# EAGLE design ZIntermediar2023 (EAGLE 6.5.0)
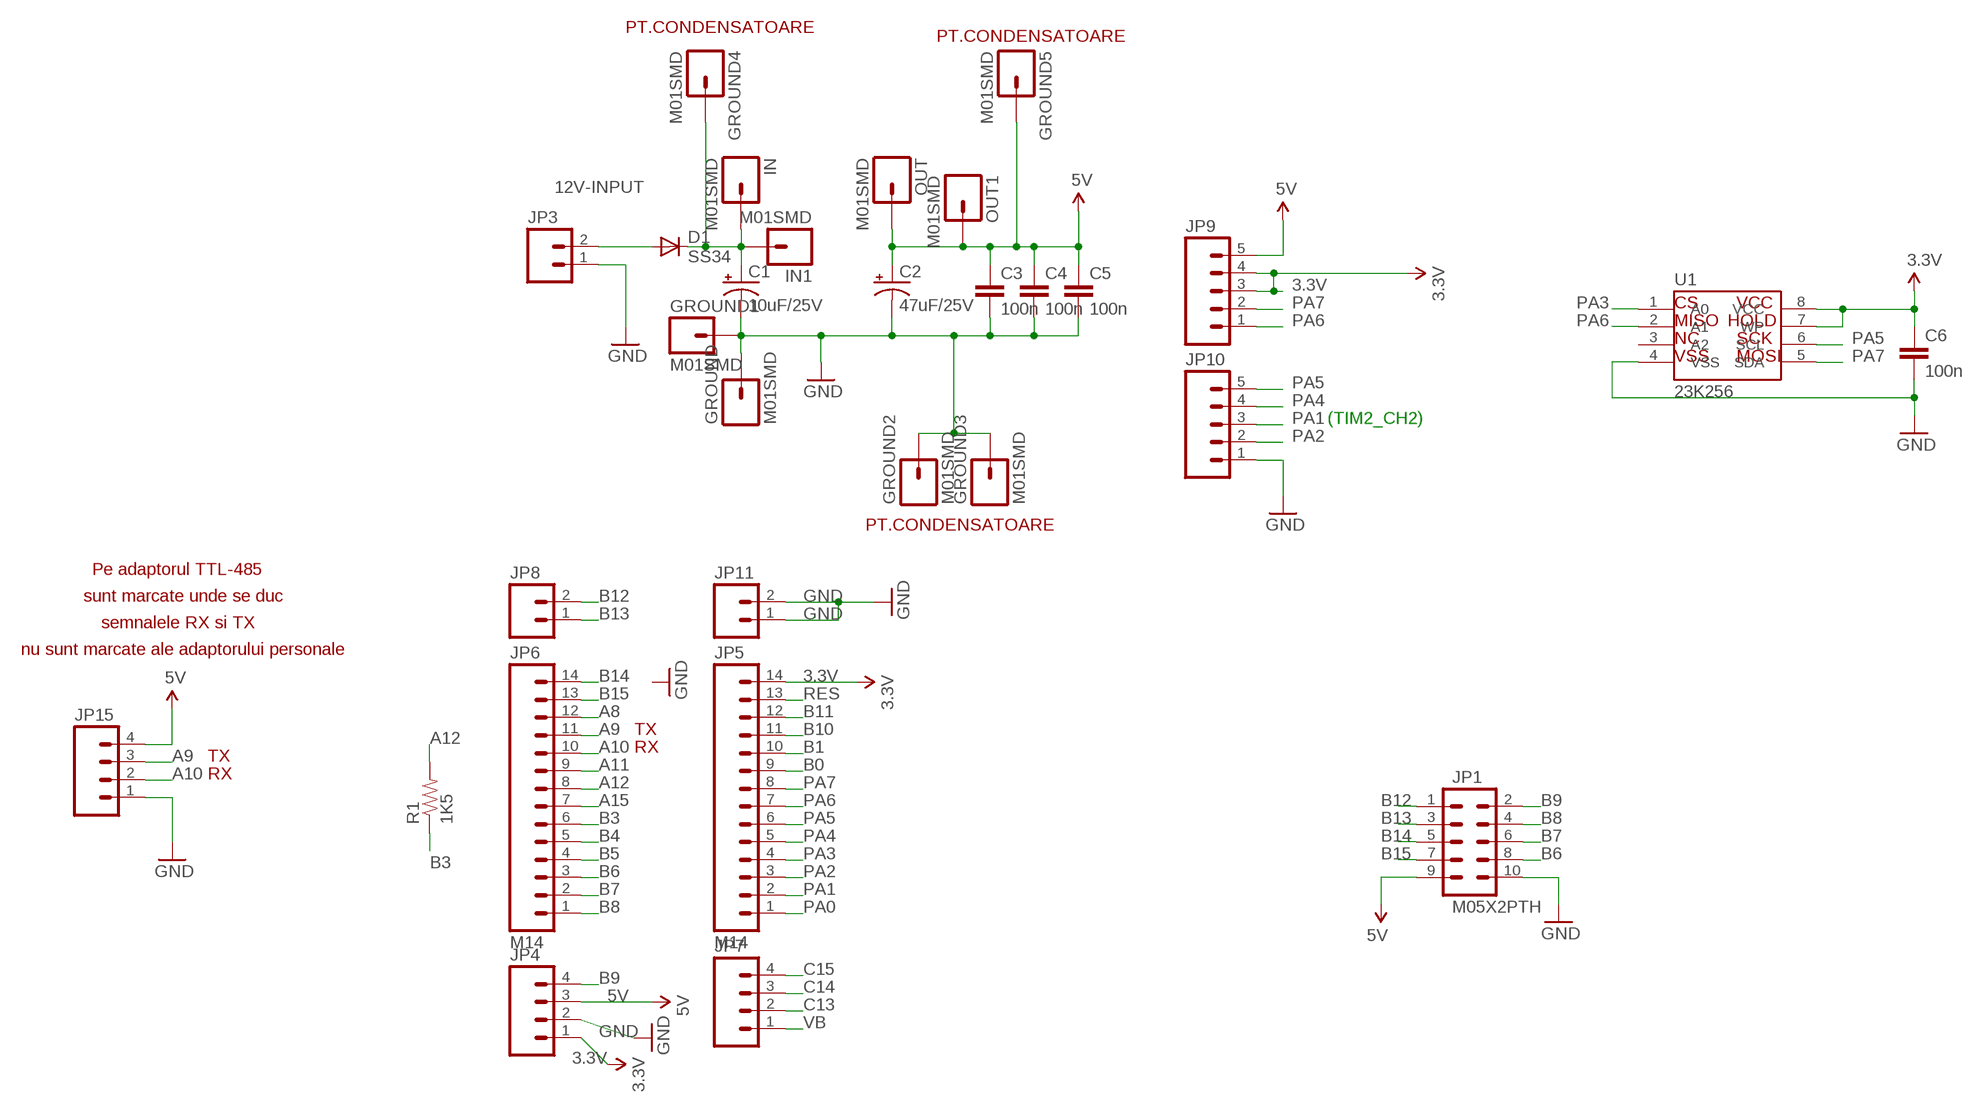
[diagram p0: schematic, sheet 1]

## Parts
C1  10uF/25V  CAP_POLE  [PANASONIC_E]
C2  47uF/25V  CAP_POLE  [PANASONIC_E]
C3  100n  CAP1206  [1206]
C4  100n  CAP1206  [1206]
C5  100n  CAP1206  [1206]
C6  100n  CAP1206  [1206]
D1  SS34  DIODE-SMC  [SMC]
GROUND  M01SMD  [LUXEON-PAD]
GROUND1  M01SMD  [LUXEON-PAD]
GROUND2  M01SMD  [LUXEON-PAD]
GROUND3  M01SMD  [LUXEON-PAD]
GROUND4  M01SMD  [LUXEON-PAD]
GROUND5  M01SMD  [LUXEON-PAD]
IN  M01SMD  [LUXEON-PAD]
IN1  M01SMD  [LUXEON-PAD]
JP1  M05X2PTH  [AVR_ICSP]
JP3  M025MM  [SCREWTERMINAL-5MM-2]
JP4  M04PTH  [1X04]
JP5  M14  [1X14]
JP6  M14  [1X14]
JP7  M04PTH  [1X04]
JP8  M02PTH  [1X02]
JP9  M05PTH_LONGPADS  [1X05_LONGPADS]
JP10  M05PTH_LONGPADS  [1X05_LONGPADS]
JP11  M02PTH  [1X02]
JP15  M04LONGPADS  [1X04_LONGPADS]
OUT  M01SMD  [LUXEON-PAD]
OUT1  M01SMD  [LUXEON-PAD]
R1  1K5  RESISTOR1206  [1206]
U1  23K256  EEPROM-I2CSMD  [SO08]

## Nets
3.3V: C6.1 JP4.1 JP5.14 JP9.3 JP9.4 U1.7(WP) U1.8(VCC)
5V: C2.+ C3.1 C4.1 C5.1 GROUND5.P$1 JP1.9 JP4.3 JP9.5 JP15.4 OUT1.P$1 OUT.P$1
12V-INPUT: C1.+ D1.C GROUND4.P$1 IN1.P$1 IN.P$1
A8: JP6.12
A9: JP6.11 JP15.3
A10: JP6.10 JP15.2
A11: JP6.9
A12: JP6.8 R1.2
A15: JP6.7
B0: JP5.9
B1: JP5.10
B3: JP6.6 R1.1
B4: JP6.5
B5: JP6.4
B6: JP1.8 JP6.3
B7: JP1.6 JP6.2
B8: JP1.4 JP6.1
B9: JP1.2 JP4.4
B10: JP5.11
B11: JP5.12
B12: JP1.1 JP8.2
B13: JP1.3 JP8.1
B14: JP1.5 JP6.14
B15: JP1.7 JP6.13
C13: JP7.2
C14: JP7.3
C15: JP7.4
GND: C1.- C2.- C3.2 C4.2 C5.2 C6.2 GROUND1.P$1 GROUND2.P$1 GROUND3.P$1 GROUND.P$1 JP1.10 JP3.1 JP4.2 JP10.1 JP11.1 JP11.2 JP15.1 U1.4(VSS)
N$7: D1.A JP3.2
PA0: JP5.1
PA1: JP5.2 JP10.3
PA2: JP5.3 JP10.2
PA3: JP5.4 U1.1(A0)
PA4: JP5.5 JP10.4
PA5: JP5.6 JP10.5 U1.6(SCL)
PA6: JP5.7 JP9.1 U1.2(A1)
PA7: JP5.8 JP9.2 U1.5(SDA)
RES: JP5.13
VB: JP7.1
Unconnected: U1.3(A2)

## Notes on the sheet
- PT.CONDENSATOARE
- PT.CONDENSATOARE
- CS | VCC
- MISO | HOLD
- NC | SCK
- VSS | MOSI
- (TIM2_CH2)
- PT.CONDENSATOARE
- Pe adaptorul TTL-485
- sunt marcate unde se duc
- semnalele RX si TX
- nu sunt marcate ale adaptorului personale
- TX
- RX
- TX
- RX

## Library data of the parts
C1 C2 = SparkFun-Passives:CAP_POL: Capacitor Polarized These are standard SMD and PTH capacitors. Normally 10uF, 47uF, and 100uF in electrolytic and tantalum varieties. Always verify the external diameter of the through hole cap, it varies with capacity, voltage, and manufacturer. The EIA devices should be standard.
C3-C6 = SparkFun-Passives:CAP: Capacitor Standard 0603 ceramic capacitor, and 0.1" leaded capacitor.
D1 = diode:DIODE-: DIODE
GROUND GROUND1-GROUND5 IN IN1 OUT OUT1 = SparkFun-Connectors:M01: Header 1 Standard 1-pin 0.1" header. Use with straight break away headers (SKU : PRT-00116), right angle break away headers (PRT-00553), swiss pins (PRT-00743), machine pins (PRT-00117), and female headers (PRT-00115).
JP1 = SparkFun-Connectors:M05X2: Header 5x2 Standard 10-pin dual row 0.1" header. Commonly used with AVR-ISP. Use with Spark Fun Electronics SKU: PRT-00778
JP3 JP8 JP11 = SparkFun-Connectors:M02: Header 2 Standard 2-pin 0.1" header. Use with straight break away headers (SKU : PRT-00116), right angle break away headers (PRT-00553), swiss pins (PRT-00743), machine pins (PRT-00117), and female headers (PRT-00115). Molex polarized connector foot print use with SKU : PRT-08233 with associated crimp pins and housings.
JP4 JP7 JP15 = SparkFun-Connectors:M04: Header 4 Standard 4-pin 0.1" header. Use with straight break away headers (SKU : PRT-00116), right angle break away headers (PRT-00553), swiss pins (PRT-00743), machine pins (PRT-00117), and female headers (PRT-00115). Molex polarized connector foot print use with SKU : PRT-08231 with associated crimp pins and housings. 1MM SMD Version SKU: PRT-10208
JP5 JP6 = SparkFun-Connectors:M14: Header 14 Standard 14-pin 0.1" header. Use with straight break away headers (SKU : PRT-00116), right angle break away headers (PRT-00553), swiss pins (PRT-00743), machine pins (PRT-00117), and female headers (PRT-00115).
JP9 JP10 = SparkFun-Connectors:M05: Header 5 Standard 5-pin 0.1" header. Use with straight break away headers (SKU : PRT-00116), right angle break away headers (PRT-00553), swiss pins (PRT-00743), machine pins (PRT-00117), and female headers (PRT-00115). Molex polarized connector foot print use with SKU : PRT-08230 with associated crimp pins and housings.
R1 = SparkFun-Passives:RESISTOR: Resistor Basic schematic elements and footprints for 0603, 1206, and PTH resistors.
U1 = SparkFun-DigitalIC:EEPROM-I2C: I2C EEPROM chips, 24LC256 (and others)

## Board
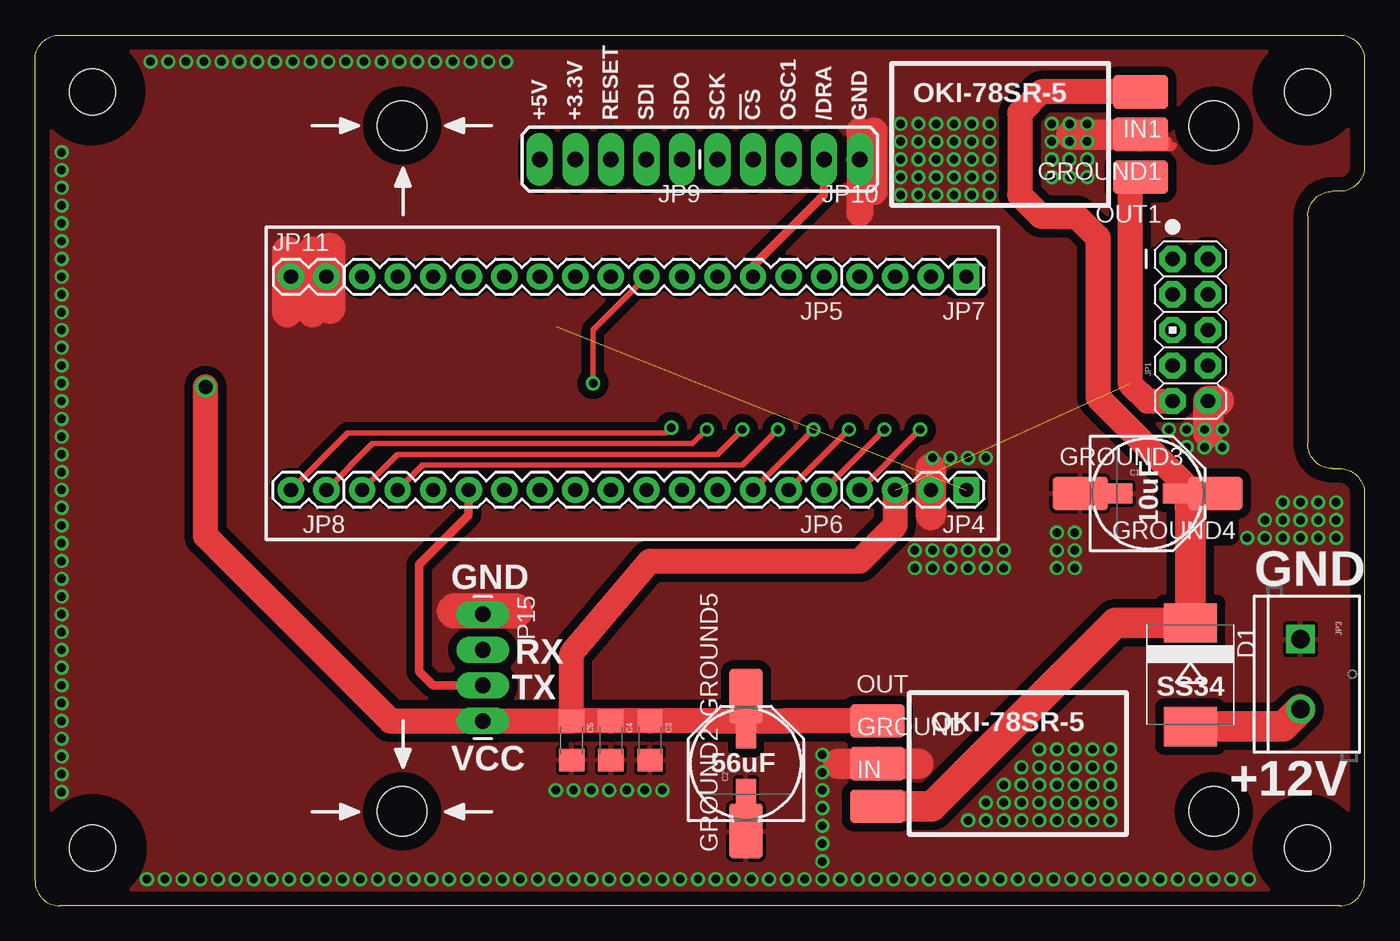
[diagram p1: board, top side]
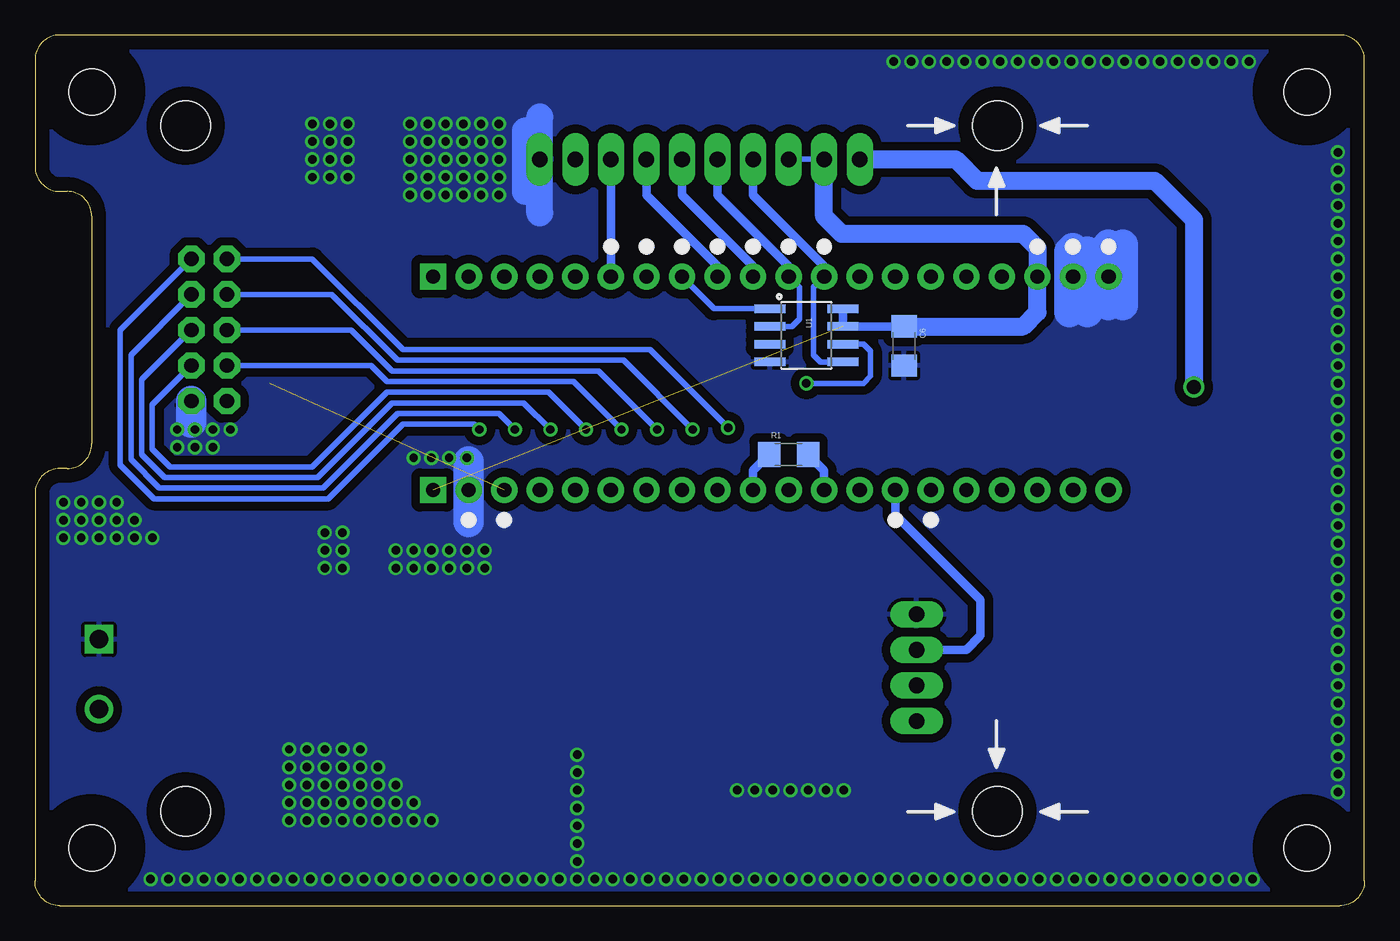
[diagram p2: board, bottom side, seen from below]

Size 95 x 62.23 mm. Coordinates in mm from the lower left corner, seen from the top.
Outline: 0,1.78 0,60.45 arc-90 1.78,62.23 93.22,62.23 arc-90 95,60.45 95,52.83 arc-90 93.22,51.05 92.71,51.05 arc90 90.93,49.28 90.93,33.02 arc90 92.71,31.24 93.22,31.24 arc-90 95,29.46 95,1.78 arc-90 93.22,0 1.78,0 arc-90 0,1.78
Copper layers (1*16): Top 0.035mm / dielectric 1.5mm / Bottom 0.035mm
Design rules "default *": minimum track width 10mil, minimum drill 24mil, track to track 8mil, track to pad 8mil, pad to pad 8mil, via to via 8mil, smd to smd 8mil, copper to edge 40mil, drill to drill 8mil, minimum pad ring 10mil, minimum via ring 8mil, stop-mask expansion 4mil, vias tented up to drill 24mil, thermal gap 10mil
Holes 3.56 mm at 26.23,55.75 84.23,6.76 26.23,6.76 84.23,55.75
tRestrict: area 1.5,1.5 to 6.7,6.7; area 1.4,55.6 to 6.6,60.8; area 88.3,1.5 to 93.5,6.7; area 88.3,55.6 to 93.5,60.8; area 84.4,26.4 to 85.4,27.7
bRestrict: area 1.5,1.5 to 6.7,6.7; area 1.5,55.6 to 6.7,60.8; area 88.4,55.6 to 93.6,60.8; area 88.4,1.5 to 93.6,6.7

### Footprints (pad centres in the part's own frame; a part is rotated, then mirrored left to right if it is on the bottom)
PANASONIC_E = smd 3.8 x 1.4: + 3,0; - -3,0
1206 = smd 1.6 x 1.8: 1 -1.4,0; 2 1.4,0
SMC = smd 2.8 x 3.8: A 3.7,0; C -3.7,0
LUXEON-PAD = smd 3.9 x 2.4: P$1 0,0
AVR_ICSP = drill 1.016 pad 1.88 octagon: 1 -1.27,5.08; 2 1.27,5.08; 3 -1.27,2.54; 4 1.27,2.54; 5 -1.27,0; 6 1.27,0; 7 -1.27,-2.54; 8 1.27,-2.54; 9 -1.27,-5.08; 10 1.27,-5.08
SCREWTERMINAL-5MM-2 = drill 1.3 pad 2.032 square: 1 0,0 | drill 1.3 pad 2.032: 2 5,0
1X04 = drill 1.016 pad 1.88 square: 1 0,0 | drill 1.016 pad 1.88: 2 2.54,0; 3 5.08,0; 4 7.62,0
1X14 = drill 1.016 pad 1.88: 1 0,0; 2 2.54,0; 3 5.08,0; 4 7.62,0; 5 10.16,0; 6 12.7,0; 7 15.24,0; 8 17.78,0; 9 20.32,0; 10 22.86,0; 11 25.4,0; 12 27.94,0; 13 30.48,0; 14 33.02,0
1X02 = drill 1.016 pad 1.88: 1 0,0; 2 2.54,0
1X05_LONGPADS = drill 1.118 pad 1.88 long: 1 0,0; 2 2.54,0; 3 5.08,0; 4 7.62,0; 5 10.16,0
1X04_LONGPADS = drill 1.118 pad 1.88 long: 1 0,0; 2 2.54,0; 3 5.08,0; 4 7.62,0
STAND-OFF = hole 3.302: 0,0
SO08 = smd 0.61 x 2.21: 1 -1.905,-2.616; 2 -0.635,-2.616; 3 0.635,-2.616; 4 1.905,-2.616; 5 1.905,2.616; 6 0.635,2.616; 7 -0.635,2.616; 8 -1.905,2.616

### Placement (x,y rotation side)
C1  79.5,29.46 0 top
C2  50.8,10.16 90 top
C3  43.94,11.81 270 top
C4  41.15,11.81 270 top
C5  38.35,11.81 270 top
C6  32.89,40.01 270 bottom
D1  82.55,16.51 270 top
GROUND  60.2,10.16 0 top
GROUND1  78.99,55.12 180 top
GROUND2  50.8,5.33 90 top
GROUND3  74.68,29.46 0 top
GROUND4  84.33,29.46 180 top
GROUND5  50.8,14.99 90 top
IN  60.2,7.11 0 top
IN1  78.99,58.17 180 top
JP1  82.55,41.15 0 top
JP3  90.42,19.05 270 top
JP4  66.55,29.72 180 top
JP5  56.39,44.96 180 top
JP6  56.39,29.72 180 top
JP7  66.55,44.96 180 top
JP8  20.83,29.72 180 top
JP9  46.23,53.34 180 top
JP10  58.93,53.34 180 top
JP11  18.29,44.96 0 top
JP15  32,20.83 270 top
OUT  60.2,13.21 0 top
OUT1  78.99,52.07 180 top
R1  41.15,32.26 0 bottom
STANDOFF1  STAND-OFF  [STAND-OFF]  90.93,4.11 0 top
STANDOFF6  STAND-OFF  [STAND-OFF]  4.11,58.17 0 top
STANDOFF10  STAND-OFF  [STAND-OFF]  90.93,58.17 0 top
STANDOFF12  STAND-OFF  [STAND-OFF]  4.11,4.11 0 top
U1  39.88,40.77 270 bottom

### Tracks (layer width: path | path; a pad name or v marks a point on that pad's centre or on a via)
3.3V  (1 unrouted)
  Bottom 0.406: JP9.4 JP9.3
  Bottom 0.61: U1.8 U1.7 34.29,41.4 C6.1
  Bottom 1.27: JP9.4 38.61,49.28 37.34,48.01 24.38,48.01 23.37,46.99 JP5.14 23.37,42.42 24.38,41.41 C6.1
5V  (via drill 1)  (1 unrouted)
  Top 0.356: 53.72,13.21 53.21,13.16 C2.+
  Top 0.406: GROUND5.P$1 C2.+
  Top 1.27: 53.39,13.21 C2.+
  Top 1.778: OUT.P$1 53.72,13.21 53.39,13.21 49.4,13.21 48.9,13.21 C3.1 C4.1 C5.1 | JP1.9 79.5,36.07 78.23,37.34 78.23,52.07 OUT1.P$1 | C5.1 38.35,18.03 43.94,24.64 58.93,24.64 61.47,27.18 JP4.3 | C5.1 34.8,13.21 34.79,13.21 JP15.4 25.4,13.21 12.19,26.42 v12.19,37.08
  Bottom 1.27: JP9.5 29.21,53.34 27.69,51.82 14.99,51.82 12.19,49.02 v12.19,37.08
12V-INPUT
  Top 0.406: C1.+ GROUND4.P$1
  Top 0.61: 82.5,26.72 C1.+
  Top 1.778: IN1.P$1 71.88,58.17 70.36,56.64 70.36,50.8 71.88,49.28 74.42,49.28 75.95,47.75 75.95,36.32 82.5,29.77 C1.+
  Top 2.184: IN.P$1 64.09,7.11 77.19,20.21 D1.C 82.55,27.05 C1.+
A9
  Top 0.61: JP6.11 30.99,27.94 27.43,24.38 27.43,16.76 28.45,15.75 JP15.3
A10
  Bottom 0.61: JP6.10 33.53,27.94 27.43,21.84 27.43,19.3 28.45,18.29 JP15.2
A12
  Bottom 0.61: R1.2 38.61,31.12 JP6.8
B3
  Bottom 0.61: R1.1 43.69,31.12 JP6.6
B6  (via drill 0.6)
  Top 0.406: JP6.3 v55.63,34.04
  Bottom 0.406: JP1.8 86.61,35.81 86.61,32.64 85.34,31.37 75.18,31.37 69.85,36.7 58.29,36.7 v55.63,34.04
B7  (via drill 0.6)
  Top 0.406: JP6.2 v58.17,34.04
  Bottom 0.406: JP1.6 87.38,37.59 87.38,32.26 85.72,30.61 74.8,30.61 69.47,35.94 60.07,35.94 v58.17,34.04
B8  (via drill 0.6)
  Top 0.406: JP6.1 v60.71,34.04
  Bottom 0.406: v60.71,34.04 61.85,35.18 69.09,35.18 74.42,29.84 86.11,29.84 88.14,31.88 88.14,39.37 JP1.4
B9  (via drill 0.6)
  Top 0.406: JP4.4 v63.25,34.04
  Bottom 0.406: v63.25,34.04 63.63,34.42 68.71,34.42 74.04,29.08 86.49,29.08 88.9,31.5 88.9,41.15 JP1.2
B12  (via drill 0.6)
  Top 0.406: JP8.2 22.35,33.78 45.09,33.78 v45.47,34.16
  Bottom 0.406: JP1.1 75.18,46.23 68.71,39.75 51.05,39.75 v45.47,34.16
B13  (via drill 0.6)
  Top 0.406: JP8.1 24.13,33.02 46.99,33.02 v48.01,34.04
  Bottom 0.406: JP1.3 73.79,43.69 69.09,38.99 52.96,38.99 v48.01,34.04
B14  (via drill 0.6)
  Top 0.406: JP6.14 25.91,32.26 48.77,32.26 v50.55,34.04
  Bottom 0.406: JP1.5 72.39,41.15 69.47,38.23 54.74,38.23 v50.55,34.04
B15  (via drill 0.6)
  Top 0.406: JP6.13 27.69,31.5 50.55,31.5 v53.09,34.04
  Bottom 0.406: JP1.7 70.99,38.61 69.85,37.47 56.52,37.47 v53.09,34.04
GND  (via drill 0.6)
  Top 0.406: 79.38,55.37 80.01,54.74 81.03,54.74 80.64,54.36 80.64,54.1 81.15,54.1 81.41,54.36 80.9,54.36 81.03,54.48 81.15,54.48
  Top 0.61: 29.97,21.08 30.23,20.83 JP15.1
  Top 1.93: 58.93,55.37 58.93,49.53 | 59.94,51.05 59.94,55.37
  Top 2.184: 63.12,10.16 57.4,10.16 | 84.58,36.07 JP1.10 83.82,33.78 | 74.04,55.12 79.76,55.12 | 64.01,27.94 64.01,31.24 | 18.03,42.42 18.03,46.74 | 19.81,42.42 19.81,46.74 | 21.08,42.67 21.08,46.99
  Top 2.54: 29.97,21.08 34.29,21.08
  Bottom 1.93: 59.94,51.05 59.94,55.37 | 58.93,49.53 58.93,56.39
  Bottom 2.184: 83.82,34.54 JP1.10 | 18.29,47.24 18.29,42.93 | 20.83,46.99 20.83,42.67 | 19.81,46.74 19.81,42.42 | 21.08,46.74 21.08,42.42 | 17.27,47.24 17.27,42.93 | 64.01,31.75 64.01,27.43
  other vias: 10.79,60.33 8.26,60.33 12.06,60.33 20.95,60.33 1.91,53.85 22.23,60.33 9.53,60.33 23.5,60.33 75.18,55.88 73.91,55.88 72.64,55.88 72.64,54.61 73.91,54.61 75.18,54.61 75.18,53.34 73.91,53.34 72.64,53.34 72.64,52.07 73.91,52.07 75.18,52.07 81.03,34.04 82.3,34.04 83.57,34.04 82.3,32.77 83.57,32.77 84.84,34.04 84.84,32.77 24.77,60.33 26.04,60.33 80.39,1.91 81.66,1.91 82.93,1.91 84.2,1.91 85.47,1.91 86.74,1.91 1.91,23.37 1.91,24.64 1.91,25.91 1.91,27.18 1.91,28.45 1.91,14.48 1.91,13.21 1.91,11.94 1.91,10.67 1.91,9.4 1.91,8.13 14.35,1.91 15.62,1.91 21.97,1.91 20.7,1.91 13.08,1.91 11.81,1.91 10.54,1.91 9.27,1.91 8,1.91 14.61,60.33 17.14,60.33 19.68,60.33 18.41,60.33 1.91,18.29 1.91,17.02 1.91,15.75 13.34,60.33 15.88,60.33 1.91,19.56 1.91,20.83 1.91,22.1 18.16,1.91 19.43,1.91 16.89,1.91 70.23,1.91 68.96,1.91 67.69,1.91 66.42,1.91 65.15,1.91 63.88,1.91 79.12,1.91 77.85,1.91 76.58,1.91 75.31,1.91 74.04,1.91 72.77,1.91 71.5,1.91 1.91,39.88 1.91,36.07 1.91,32.26 1.91,30.99 1.91,34.8 1.91,38.61 1.91,37.34 1.91,33.53 1.91,29.72 37.21,1.91 44.83,1.91 29.59,1.91 51.18,1.91 52.45,1.91 62.61,1.91 53.72,1.91 34.67,1.91 35.94,1.91 43.56,1.91 28.32,1.91 56.26,1.91 57.53,1.91 58.8,1.91 60.07,1.91 61.34,1.91 49.91,1.91 48.64,1.91 47.37,1.91 46.1,1.91 54.99,1.91 27.05,1.91 42.29,1.91 33.4,1.91 41.02,1.91 25.78,1.91 24.51,1.91 39.75,1.91 32.13,1.91 30.86,1.91 38.48,1.91 23.24,1.91 1.91,52.58 1.91,51.31 1.91,50.04 1.91,48.77 1.91,47.5 1.91,41.15 1.91,42.42 1.91,43.69 1.91,44.96 1.91,46.23 28.57,60.33 29.84,60.33 31.11,60.33 32.38,60.33 33.66,60.33 27.3,60.33 68.2,55.88 66.93,55.88 65.66,55.88 65.66,54.61 66.93,54.61 68.2,54.61 68.2,53.34 66.93,53.34 65.66,53.34 65.66,52.07 66.93,52.07 68.2,52.07 73.03,6.1 70.48,8.64 69.22,7.37 67.94,7.37 71.75,9.91 73.03,7.37 75.56,6.1 71.75,8.64 70.48,6.1 69.22,6.1 71.75,7.37 75.56,7.37 38.48,8.26 73.03,9.91 73.03,11.18 39.75,8.26 41.02,8.26 74.3,6.1 74.3,7.37 42.29,8.26 75.56,8.64 71.75,6.1 67.94,6.1 66.67,6.1 70.48,9.91 75.56,9.91 43.56,8.26 74.3,8.64 74.3,9.91 44.83,8.26 71.75,11.18 70.48,7.37 69.22,8.64 37.21,8.26 73.03,8.64 65.66,50.8 66.93,50.8 68.2,50.8 64.39,55.88 63.12,55.88 61.85,55.88 61.85,54.61 63.12,54.61 64.39,54.61 64.39,53.34 63.12,53.34 61.85,53.34 61.85,52.07 63.12,52.07 64.39,52.07 61.85,50.8 63.12,50.8 64.39,50.8 92.96,26.29 66.67,24.13 65.41,24.13 64.14,24.13 62.87,24.13 89.15,26.29 91.69,26.29 76.83,8.64 76.83,7.37 87.88,26.29 56.26,10.79 74.3,24.13 64.14,32 65.41,32 74.3,26.67 73.03,24.13 74.3,25.4 73.03,26.67 66.67,32 76.83,11.18 76.83,9.91 65.41,25.4 62.87,25.4 64.14,25.4 66.67,25.4 67.94,25.4 56.26,9.53 69.22,24.13 67.94,32 73.03,25.4 67.94,24.13 69.22,25.4 56.26,6.99 56.26,4.45 56.26,8.26 56.26,5.71 56.26,3.17 74.3,11.18 86.61,26.29 90.42,26.29 76.83,6.1 75.56,11.18 87.88,27.56 89.15,27.56 90.42,27.56 91.69,27.56 92.96,27.56 89.15,28.83 90.42,28.83 91.69,28.83 92.96,28.83
  pour Bottom (isolate 0.61): 0,0 95,0 95,62.23 0,62.23
  pour Top (isolate 0.61): 0,62.23 95,62.23 95,0 0,0
N$7
  Top 2.184: JP3.2 89.18,12.81 D1.A
PA1
  Bottom 0.61: JP5.2 JP10.3
PA2
  Top 0.61: JP5.3 51.31,45.72 56.39,50.8 JP10.2
PA3
  Bottom 0.406: U1.1 46.48,42.67 JP5.4
PA4
  Bottom 0.61: JP5.5 46.23,45.72 51.31,50.8 JP10.4
PA5  (via drill 0.6)
  Top 0.406: v39.88,37.34 39.88,41.15 JP5.6
  Bottom 0.406: U1.6 35.81,40.13 35.31,39.62 35.31,37.85 35.81,37.34 v39.88,37.34
  Bottom 0.61: JP5.6 43.69,45.72 48.77,50.8 JP10.5
PA6
  Bottom 0.406: U1.2 40.89,41.4 40.39,41.91 40.39,44.2 JP5.7
  Bottom 0.61: JP5.7 41.15,45.72 46.23,50.8 JP9.1
PA7
  Bottom 0.406: 37.34,38.86 U1.5 38.86,38.86 39.37,39.37 39.37,44.2 JP5.8
  Bottom 0.61: JP5.8 38.61,45.72 43.69,50.8 JP9.2

### Text on the board
tPlace: OKI-78SR-5 | +5V | +3.3V | RESET | SDI | SDO | SCK | CS | OSC1 | /DRA | GND | 10uF | GND | GND | RX | TX | SS34 | OKI-78SR-5 | VCC | 56uF | +12V